# Altium schematic sheet Digital_Clock_SCH_2.0.SchDoc
size A; SheetNumber: 1; SheetTotal: 3
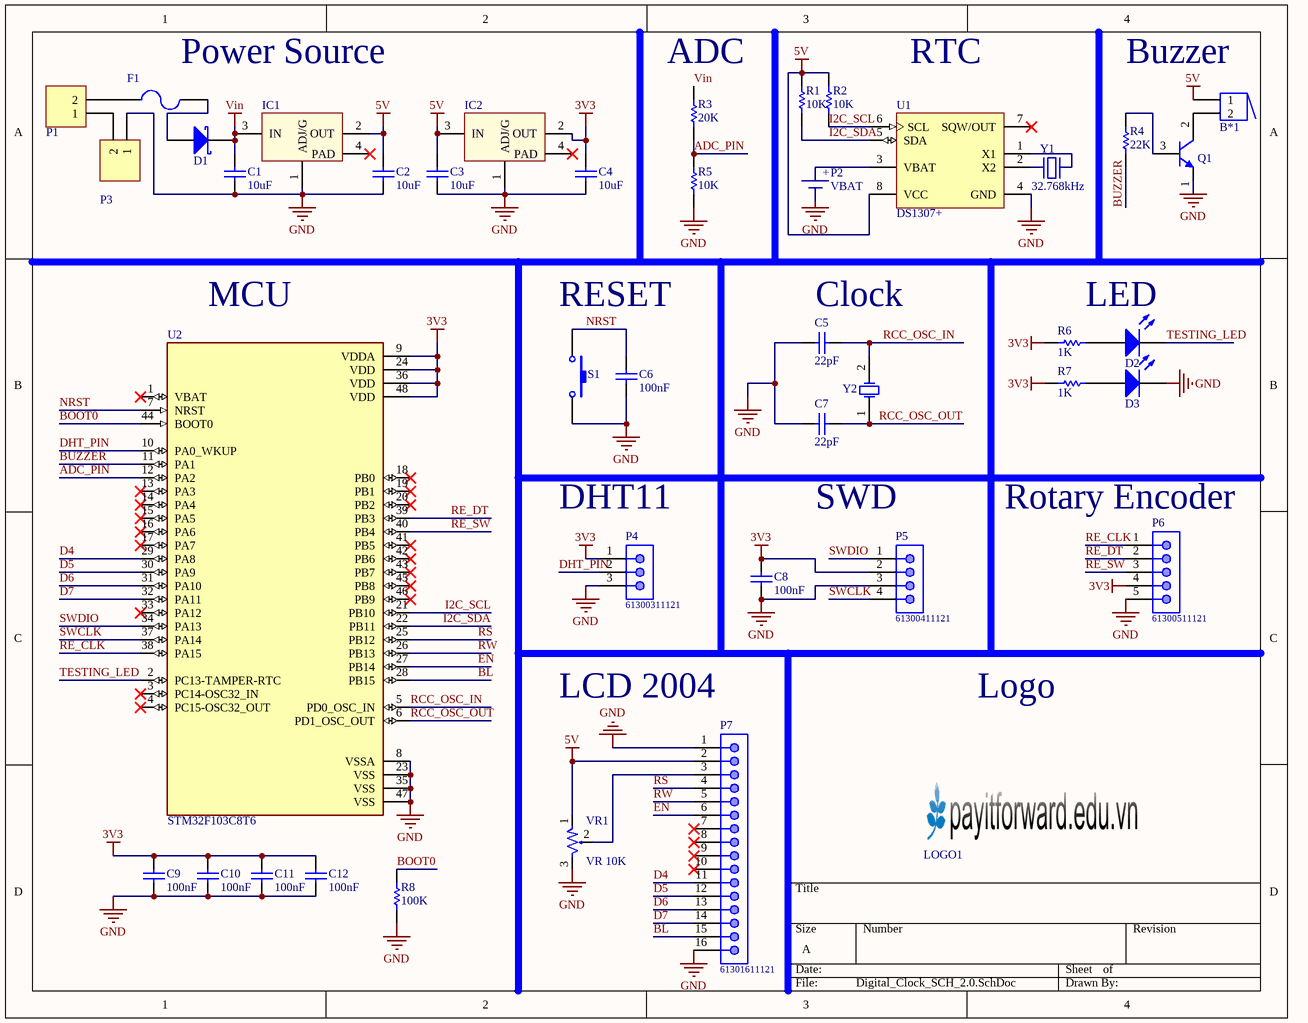
[diagram p0: Digital_Clock_SCH_2.0.SchDoc]

## Parts
B*1  Buzzer  [BUZZER]  (value not drawn)
C1  value 10uF  [CAP-SM-0805]  (hidden comment: Cap Non-Pol SMD)
C2  value 10uF  [CAP-SM-0805]  (hidden comment: Cap Non-Pol SMD)
C3  value 10uF  [CAP-SM-0805]  (hidden comment: Cap Non-Pol SMD)
C4  value 10uF  [CAP-SM-0805]  (hidden comment: Cap Non-Pol SMD)
C5  value 22pF  [CAP-SM-0603]  (hidden comment: Cap Non-Pol SMD)
C6  value 100nF  [CAP-SM-0603]  (hidden comment: Cap Non-Pol SMD)
C7  value 22pF  [CAP-SM-0603]  (hidden comment: Cap Non-Pol SMD)
C8  value 100nF  [CAP-SM-0603]  (hidden comment: Cap Non-Pol SMD)
C9  value 100nF  [CAP-SM-0603]  (hidden comment: Cap Non-Pol SMD)
C10  value 100nF  [CAP-SM-0603]  (hidden comment: Cap Non-Pol SMD)
C11  value 100nF  [CAP-SM-0603]  (hidden comment: Cap Non-Pol SMD)
C12  value 100nF  [CAP-SM-0603]  (hidden comment: Cap Non-Pol SMD)
D1  D Schottky  [SS34]  (value not drawn)
D2  LED SMD  [LED_0805_Blue]  (value not drawn)
D3  LED SMD  [LED_0805_Blue]  (value not drawn)
F1  Fuse  [FUSE SMD]  (value not drawn)
IC1  LM1117  [SOT223-4N]  (value not drawn)
IC2  LM1117  [SOT223-4N]  (value not drawn)
LOGO1  LOGO PIF  [PIF LOGO BIG SSTOP]  (value not drawn)
P1  Domino 2  [DOMINO SMALL 2]  (value not drawn)
P2  VBAT  [VBAT CR2030]
P3  Domino 2  [DOMINO SMALL 2]  (value not drawn)
P4  61300311121  [61300311121]
P5  61300411121  [61300411121]
P6  61300511121  [61300511121]
P7  61301611121  [61301611121]
Q1  C1815  [SOT23B]  (value not drawn)
R1  value 10K  [RES-SM-0603]  (hidden comment: RESISTOR SMD)
R2  value 10K  [RES-SM-0603]  (hidden comment: RESISTOR SMD)
R3  value 20K  [RES-SM-0603]  (hidden comment: RESISTOR SMD)
R4  value 22K  [RES-SM-0603]  (hidden comment: RESISTOR SMD)
R5  value 10K  [RES-SM-0603]  (hidden comment: RESISTOR SMD)
R6  value 1K  [RES-SM-0603]  (hidden comment: RESISTOR SMD)
R7  value 1K  [RES-SM-0603]  (hidden comment: RESISTOR SMD)
R8  value 100K  [RES-SM-0603]  (hidden comment: RESISTOR SMD)
S1  Tact SW - 2Pin  [SW-SMD]  (value not drawn)
U1  DS1307+  [MAXM-P8-1]
U2  STM32F103C8T6  [QFP50P900X900X160-48N]
VR1  value VR 10K  [Varistor 1]  (hidden comment: 10K)
Y1  32.768kHz  [XTAL 32768 3x8]
Y2  XTAL  [XT2]  (value not drawn)

## Nets
3V3: C4.2 C8.2 C9.2 C10.2 C11.2 C12.2 IC2.2(OUT) P4.1 P5.2 P6.4 R6.1 R7.1 U2.9(VDDA) U2.24(VDD) U2.36(VDD) U2.48(VDD)
5V: B*1.1 C2.2 C3.2 IC1.2(OUT) IC2.3(IN) P7.2 R1.2 R2.2 U1.8(VCC) VR1.1
GND: C1.1 C2.1 C3.1 C4.1 C5.1 C6.1 C7.2 C8.1 C9.1 C10.1 C11.1 C12.1 D3.2(K) IC1.1(ADJ/G) IC2.1(ADJ/G) P2.2(+) P3.1 P4.3 P5.3 P6.5 P7.1 P7.16 Q1.1(E) R5.1 R8.1 S1.2 U1.4(GND) U2.8(VSSA) U2.23(VSS) U2.35(VSS) U2.47(VSS) VR1.3
Vin: C1.2 D1.2(K) IC1.3(IN) R3.2
ADC_PIN: R3.1 R5.2 U2.12(PA2)
BL: P7.15 U2.28(PB15)
BOOT0: R8.2 U2.44(BOOT0)
BUZZER: R4.1 U2.11(PA1)
D4: P7.11 U2.29(PA8)
D5: P7.12 U2.30(PA9)
D6: P7.13 U2.31(PA10)
D7: P7.14 U2.32(PA11)
DHT_PIN: P4.2 U2.10(PA0_WKUP)
EN: P7.6 U2.27(PB14)
I2C_SCL: R2.1 U1.6(SCL) U2.21(PB10)
I2C_SDA: R1.1 U1.5(SDA) U2.22(PB11)
NRST: C6.2 S1.1 U2.7(NRST)
RCC_OSC_IN: C5.2 U2.5(PD0_OSC_IN) Y2.2(OSC2)
RCC_OSC_OUT: C7.1 U2.6(PD1_OSC_OUT) Y2.1(OSC1)
RE_CLK: P6.1 U2.38(PA15)
RE_DT: P6.2 U2.39(PB3)
RE_SW: P6.3 U2.40(PB4)
RS: P7.4 U2.25(PB12)
RW: P7.5 U2.26(PB13)
SWCLK: P5.4 U2.37(PA14)
SWDIO: P5.1 U2.34(PA13)
TESTING_LED: D2.2(K) U2.2(PC13-TAMPER-RTC)
NetB*1_2: B*1.2 Q1.2(C)
NetD1_1: D1.1(A) F1.1
NetD2_1: D2.1(A) R6.2
NetD3_1: D3.1(A) R7.2
NetF1_2: F1.2 P1.2
NetP1_1: P1.1 P3.2
NetP2_1: P2.1(+) U1.3(VBAT)
NetP7_3: P7.3 VR1.2
NetQ1_3: Q1.3(B) R4.2
NetU1_1: U1.1(X1) Y1.2
NetU1_2: U1.2(X2) Y1.1

Not connected (* = marked no-connect by the designer): IC1 4(PAD)*; IC2 4(PAD)*; P7 7* 8* 9* 10*; U1 7(SQW/OUT)*; U2 1(VBAT)* 3(PC14-OSC32_IN)* 4(PC15-OSC32_OUT)* 13(PA3)* 14(PA4)* 15(PA5)* 16(PA6)* 17(PA7)* 18(PB0)* 19(PB1)* 20(PB2)* 33(PA12)* 41(PB5)* 42(PB6)* 43(PB7)* 45(PB8)* 46(PB9)*

## Notes on the sheet
- (near F1) Power Source
- (near R3) ADC
- RTC
- (near B*1) Buzzer
- (near U2) MCU
- RESET
- (near C5) Clock
- LED
- (near P4) DHT11
- SWD
- (near P6) Rotary Encoder
- (near P7) LCD 2004
- Logo

## Library data of the parts
C1-C12 = Cap Non-Pol SMD: Capacitor
D1 = D Schottky: Schottky Diode; Published: 8-Jun-2000; LatestRevisionDate: 17-Jul-2002; LatestRevisionNote: Re-released for DXP Platform.; PackageReference: SMB; Publisher: Altium Limited; PackageDescription: DO-214-AA/SMB; 2 C-Bend Leads; Body 5.3 x 3.6 mm, inc. leads (LxW); Code_JEDEC: DO-214-AA
D2 D3 = LED SMD: LED
IC1 IC2 = LM1117: Available in 1.8V, 2.5V, 2.85V, 3.3V, 5V, and  Adjustable Versions; Value: LM317
P1 P3 = Domino 2: Domino, 2-Pin; LatestRevisionDate: 17-Jul-2002; LatestRevisionNote: Re-released for DXP Platform.; Publisher: Altium Limited
P2 = VBAT CR2032: CR2032; Manufacturer: DANTONA INDUSTRIES; Manufacturer Part Number: CR2032 SANYO; Supplier 1: Newark; RoHS: NA; Stock 1: 1694; Pricing 1: 1=0.768, 5=0.655, 10=0.615, 25=0.565, 50=0.51, 100=0.46, 250=0.41 (USD); ComponentLink1URL: http://www.farnell.com/datasheets/1797668.pdf; ComponentLink1Description: http://www.farnell.com/datasheets/1797668.pdf; ComponentLink2URL: /datasheets/DANTONA/CRSANYO.pdf; ComponentLink2Description: /datasheets/DANTONA/CRSANYO.pdf
P4 = 61300311121: WR-PHD Pin Header, THT, pitch 2.54mm, Single Row, Vertical, 3p; Manufacturer: Wurth Elektronik; Pin Number: 3; Rated Current: 3A; Working Voltage: 250VAC; Withstanding Voltage: 500VAC; Contact Resistance: 20mOhm; ComponentLink1Description: Manufacturer; ComponentLink1URL: http://www.we-online.de; ComponentLink2Description: Datasheet; ComponentLink2URL: https://www.we-online.com/catalog/datasheet/61300311121.pdf; Manufacturer Part Number: 61300311121; Published Date: May 2020; Pitch: 2.54mm; Operating Temperature: -40 to +105degC; Mounting Technology: THT; Packaging: Bag; Gender: Pin Header; Row Number: Single; Orientation: Vertical
P5 = 61300411121: WR-PHD Pin Header, THT, pitch 2.54mm, Single Row, Vertical, 4p; Manufacturer: Wurth Elektronik; Pin Number: 4; Rated Current: 3A; Working Voltage: 250VAC; Withstanding Voltage: 500VAC; Contact Resistance: 20mOhm; ComponentLink1Description: Manufacturer; ComponentLink1URL: http://www.we-online.de; ComponentLink2Description: Datasheet; ComponentLink2URL: https://www.we-online.com/catalog/datasheet/61300411121.pdf; Manufacturer Part Number: 61300411121; Published Date: May 2020; Pitch: 2.54mm; Operating Temperature: -40 to +105degC; Mounting Technology: THT; Packaging: Bag; Gender: Pin Header; Row Number: Single; Orientation: Vertical
P6 = 61300511121: WR-PHD Pin Header, THT, pitch 2.54mm, Single Row, Vertical, 5p; Manufacturer: Wurth Elektronik; Pin Number: 5; Rated Current: 3A; Working Voltage: 250VAC; Withstanding Voltage: 500VAC; Contact Resistance: 20mOhm; ComponentLink1Description: Manufacturer; ComponentLink1URL: http://www.we-online.de; ComponentLink2Description: Datasheet; ComponentLink2URL: https://www.we-online.com/catalog/datasheet/61300511121.pdf; Manufacturer Part Number: 61300511121; Published Date: May 2020; Pitch: 2.54mm; Operating Temperature: -40 to +105degC; Mounting Technology: THT; Packaging: Bag; Gender: Pin Header; Row Number: Single; Orientation: Vertical
P7 = 61301611121: WR-PHD Pin Header, THT, pitch 2.54mm, Single Row, Vertical, 16p; Manufacturer: Wurth Elektronik; Pin Number: 16; Rated Current: 3A; Working Voltage: 250VAC; Withstanding Voltage: 500VAC; Contact Resistance: 20mOhm; ComponentLink1Description: Manufacturer; ComponentLink1URL: http://www.we-online.de; ComponentLink2Description: Datasheet; ComponentLink2URL: https://www.we-online.com/catalog/datasheet/61301611121.pdf; Manufacturer Part Number: 61301611121; Published Date: May 2020; Pitch: 2.54mm; Operating Temperature: -40 to +105degC; Mounting Technology: THT; Packaging: Bag; Gender: Pin Header; Row Number: Single; Orientation: Vertical
Q1 = C1815: NPN Bipolar Transistor
R1-R8 = RESISTOR SMD: Resistor
S1 = Tact SW - 2Pin: Switch button 2 pin
U1 = CMP-016-00004-3: I2C Real-Time Clock, 5 V, 0 to 70 degC, 8-Pin DIP, RoHS, Tube; Manufacturer: Maxim; Min Supply Voltage: 4.5V; Interface: Serial; Nominal Supply Voltage: 5V; Package Version: Rev. E, 04/2011; Max Supply Voltage: 5.5V; RoHS Compliant: True; Manufacturer URL: http://www.maximintegrated.com/; Datasheet Version: Rev. 100208, 10/2008; Datasheet URL: https://datasheet.ciiva.com/20167/82-0567-20167410.pdf; Mounting Technology: TH; Package Quantity: 50; Packaging: Rail/Tube; Package Description: 8-Pin Plastic Dual-In-Line, Narrow (0.3in) (P8-1), Body 9.375 x 6.985 mm, Pitch 2.54 mm; Case/Package: DIP; Min Operating Temperature: 0°C; Package URL: http://pdfserv.maximintegrated.com/package_dwgs/21-0043.PDF; Pins: 8; Max Operating Temperature: 70°C; Package Reference: P8-1
U2 = STM32F103C8T6: Mainstream Performance line, ARM Cortex-M3 MCU with 64 Kbytes Flash, 72 MHz CPU, motor control, USB and CAN; Value: *; Availability: Unavailable; Price: None; Package: None; MP: STM32F103C8T6
VR1 = Var Resistor
Y1 = XTAL: Crystal For all Crystal 2pin
Y2 = XTAL: Crystal Oscillator; Published: 8-Jun-2000; LatestRevisionDate: 17-Jul-2002; LatestRevisionNote: Re-released for DXP Platform.; PackageReference: R38; Publisher: Altium Limited; PackageDescription: Crystal, Thru-Hole; 2 Leads; Body 3.1 x 8.2 mm (Dia.xH)